# Altium schematic sheet CATS-GS-PM.SchDoc: CATS Groundstation
size A4; DocumentNumber: Overview; Revision: V1.0; SheetNumber: 2; SheetTotal: 9; Author: Luca Jost; Subtitle: Power Management
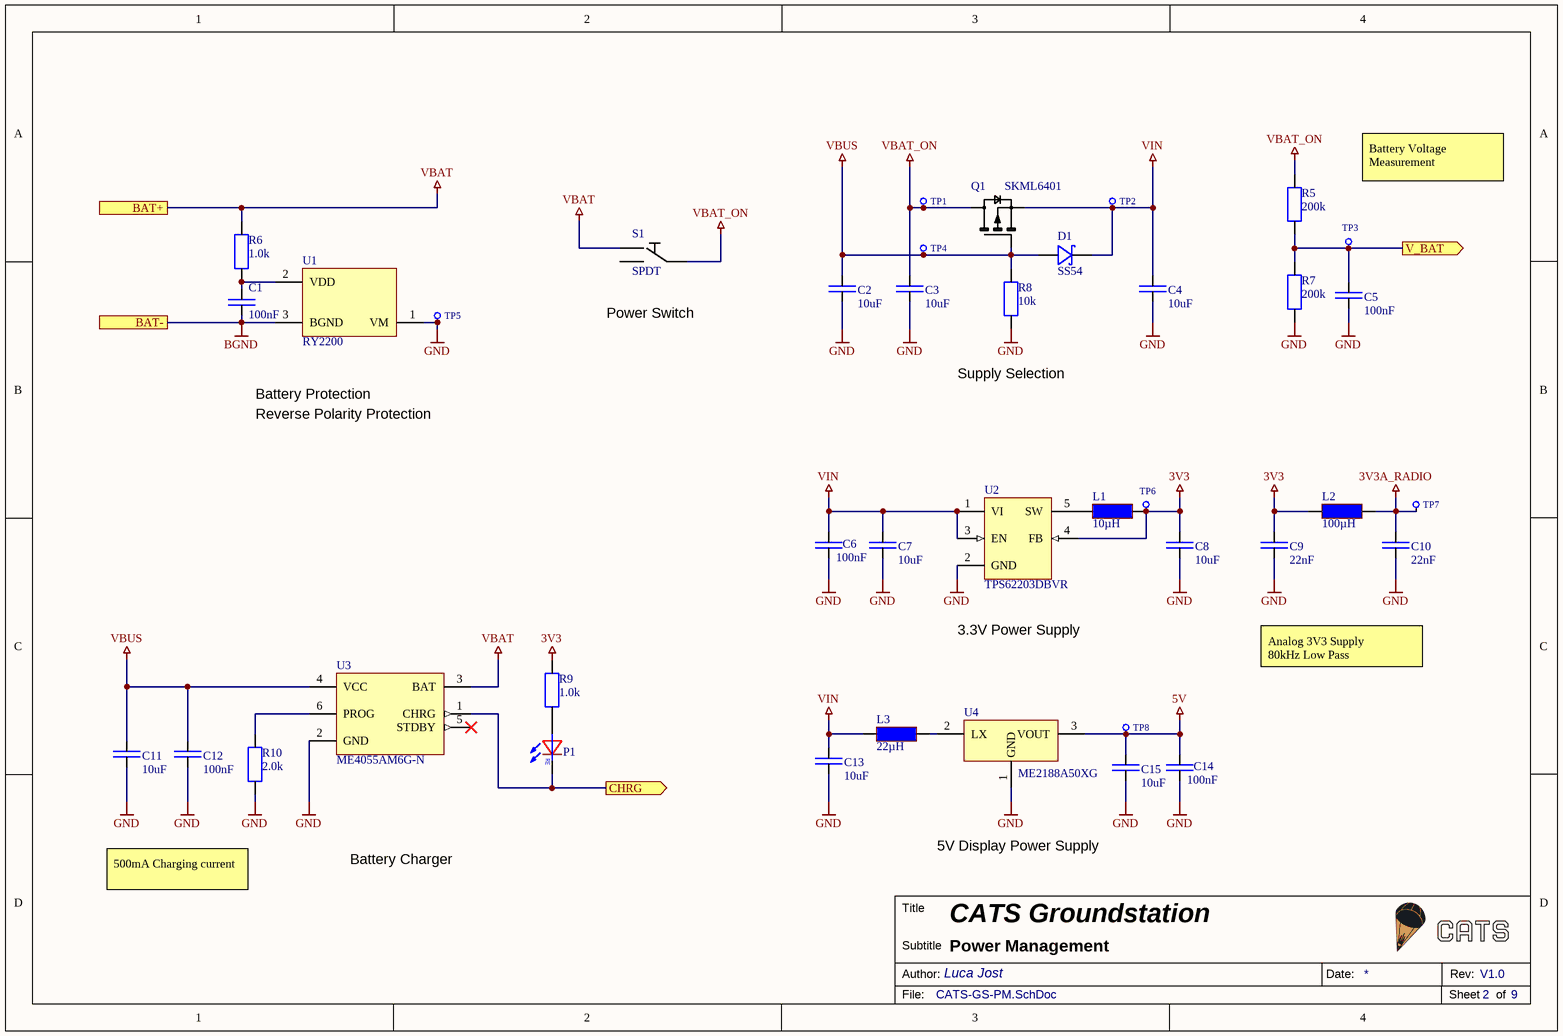
[diagram p0: CATS-GS-PM.SchDoc]

## Parts
C1  100nF  [SMD Keramikkondensator 0402]
C2  10uF  [SMD Keramikkondensator 0603]
C3  10uF  [SMD Keramikkondensator 0603]
C4  10uF  [SMD Keramikkondensator 0603]
C5  100nF  [SMD Keramikkondensator 0402]
C6  100nF  [SMD Keramikkondensator 0402]
C7  10uF  [SMD Keramikkondensator 0603]
C8  10uF  [SMD Keramikkondensator 0603]
C9  22nF  [SMD Keramikkondensator 0603]
C10  22nF  [SMD Keramikkondensator 0603]
C11  10uF  [SMD Keramikkondensator 0603]
C12  100nF  [SMD Keramikkondensator 0402]
C13  10uF  [SMD Keramikkondensator 0603]
C14  100nF  [SMD Keramikkondensator 0402]
C15  10uF  [SMD Keramikkondensator 0603]
D1  SS54  [SMD Diode DO-214-AC]
L1  10µH  [SMD Inductor 4x4x1.8]
L2  100µH  [SMD Inductor 1812]
L3  22µH  [SMD Inductor 4x4x1.8]
P1  LED  [SMD LED 0603]  (value not drawn)
Q1  SKML6401  [SMD MOSFET SOT-23]
R5  200k  [SMD Widerstand 0402]
R6  1.0k  [SMD Widerstand 0402]
R7  200k  [SMD Widerstand 0402]
R8  10k  [SMD Widerstand 0402]
R9  1.0k  [SMD Widerstand 0402]
R10  2.0k  [SMD Widerstand 0402]
S1  SPDT  [SMD Switch SPDT 90° G-Switch]
TP1  X-TP  [SMD Testpoint 1mm]  (value not drawn)  (no BOM)
TP2  X-TP  [SMD Testpoint 1mm]  (value not drawn)  (no BOM)
TP3  X-TP  [SMD Testpoint 1mm]  (value not drawn)  (no BOM)
TP4  X-TP  [SMD Testpoint 1mm]  (value not drawn)  (no BOM)
TP5  X-TP  [SMD Testpoint 1mm]  (value not drawn)  (no BOM)
TP6  X-TP  [SMD Testpoint 1mm]  (value not drawn)  (no BOM)
TP7  X-TP  [SMD Testpoint 1mm]  (value not drawn)  (no BOM)
TP8  X-TP  [SMD Testpoint 1mm]  (value not drawn)  (no BOM)
U1  RY2200  [SMD IC SOT-23]
U2  TPS62203DBVR  [SMD IC SOT-23-5]
U3  ME4055AM6G-N  [SMD IC SOT-23-6]
U4  ME2188A50XG  [SMD IC SOT-23]

## Ports
BAT+, BAT-, CHRG (out), V_BAT (out)

## Nets
3V3: C8.2 C9.2 L1.2 L2.1 R9.2 TP6.1 U2.4(FB)
3V3A_RADIO: C10.2 L2.2 TP7.1
5V: C14.2 C15.2 TP8.1 U4.3(VOUT)
BGND: C1.1 U1.3(BGND) ; port BAT-
GND: C2.1 C3.1 C4.1 C5.1 C6.1 C7.1 C8.1 C9.1 C10.1 C11.1 C12.1 C13.1 C14.1 C15.1 R7.1 R8.1 R10.1 TP5.1 U1.1(VM) U2.2(GND) U3.2(GND) U4.1(GND)
VBAT: R6.2 S1.3 U3.3(BAT) ; port BAT+
VBAT_ON: C3.2 Q1.D R5.2 S1.2 TP1.1
VBUS: C2.2 C11.2 C12.2 D1.A Q1.G R8.2 TP4.1 U3.4(VCC)
VIN: C4.2 C6.2 C7.2 C13.2 D1.K L3.1 Q1.S TP2.1 U2.1(VI) U2.3(EN)
CHRG: P1.K U3.1(CHRG) ; port CHRG
V_BAT: C5.2 R5.1 R7.2 TP3.1 ; port V_BAT
NetC1_2: C1.2 R6.1 U1.2(VDD)
NetL1_1: L1.1 U2.5(SW)
NetL3_2: L3.2 U4.2(LX)
NetP1_A: P1.A R9.1
NetR10_2: R10.2 U3.6(PROG)

Not connected (* = marked no-connect by the designer): S1 1; U3 5(STDBY)*

## Notes on the sheet
- Battery Voltage Measurement
- (near S1) Power Switch
- (near R8) Supply Selection
- Reverse Polarity Protection
- Battery Protection
- 3.3V Power Supply
- Analog 3V3 Supply
  80kHz Low Pass
- 5V Display Power Supply
- 500mA Charging current
- Battery Charger
- Title
- Author:
- Subtitle
- Date:
- Rev:
- File:
- Sheet
- of
- (in symbol LED) RE

## Library data of the parts
C1 C5 C6 C12 C14 = E6 - 100nF: SMD Ceramic Capacitor E6; Unit Price: 0.01; JLC: C307331
C2-C4 C7 C8 C11 C13 C15 = E6 - 10uF: SMD Ceramic Capacitor E6; Unit Price: 0.01; JLC: C70225
C9 C10 = E6 - 22nF: SMD Ceramic Capacitor E6; Unit Price: 0.01; JLC: C1729
D1 = SS54: 40V 5A 550mV @ 5A SMA(DO-214AC) Schottky Barrier Diodes (SBD) ROHS; ComponentLink1Description: Datasheet; ComponentLink1URL: https://datasheet.lcsc.com/lcsc/1810192041_MDD%EF%BC%88Microdiode-Electronics%EF%BC%89-SS54_C22452.pdf; JLC: C22452; Unit Price: 0.07
L1 = Inductor 10µH / 1.6A: 165mOhm SMD, 1.6A; ComponentLink1Description: Datasheet; ComponentLink1URL: https://datasheet.lcsc.com/lcsc/2108131530_SXN-Shun-Xiang-Nuo-Elec-SMNR4020-10UH_C135263.pdf; JLC: C135263; Unit Price: 0.07
L2 = Inductor 100µH / 0.25A: 0.25A 100µH ±20% 144mΩ SMD Power Inductors; ComponentLink1Description: Datasheet; ComponentLink1URL: https://datasheet.lcsc.com/lcsc/2110081330_Sunlord-SPH252012H3R3MT_C98379.pdf; JLC: C76822; Unit Price: 0.19
L3 = Inductor 22µH / 1A: 350mOhm SMD, 1A; ComponentLink1Description: Datasheet; ComponentLink1URL: https://datasheet.lcsc.com/lcsc/2108131530_SXN-Shun-Xiang-Nuo-Elec-SMNR4020-22UH_C135264.pdf; JLC: C135264
P1 = LED: Color LED; JLC: C2286
Q1 = SKML6401: P Channel MOSFET, 16V 3A, SOT-23; JLC: C475708; ComponentLink1Description: Datasheet; ComponentLink1URL: https://datasheet.lcsc.com/lcsc/2001131004_Shikues-SKML6401_C475708.pdf
R5 R7 = E24 - 200k: SMD Chip Resistor E24; Unit Price: 0.01; JLC: C25764
R6 R9 = E24 - 1.0k: SMD Chip Resistor E24; Unit Price: 0.01; JLC: C11702
R8 = E24 - 10k: SMD Chip Resistor E24; Unit Price: 0.01; Number: -; Supplier: -; JLC: C25744
R10 = E24 - 2.0k: SMD Chip Resistor E24; Unit Price: 0.01; Number: -; Supplier: -; JLC: C25879
S1 = Switch SPDT G-Switch: Slide Switch SPDT SMD; ComponentLink1Description: Datasheet; ComponentLink1URL: https://datasheet.lcsc.com/lcsc/2009021103_G-Switch-MK-12C02-G025_C778186.pdf; JLC: C778186
TP1 TP2 TP4 TP5 TP7 TP8 = X-TP: Testpunkt; Component Value: Ø 0.8mm; Component Description: Testpoint; Unit Price: 0.00
TP3 TP6 = X-TP: Testpunkt; Unit Price: 0.00
U1 = RY2200: One Cell Li-ion and Li-poly Battery Protection IC; JLC: C2888102; ComponentLink1Description: Datasheet; ComponentLink1URL: https://datasheet.lcsc.com/lcsc/2108251630_RYCHIP-Semiconductor-Inc--RY2200_C2888102.pdf
U2 = TPS62203DBVR: High-Efficiency Synchronous Step-Down / synchronous step-down converters ideally suited for Converter 3.3V; ComponentLink1Description: Datasheet; ComponentLink1URL: https://www.ti.com/lit/ds/symlink/tps62203.pdf?HQS=dis-mous-null-mousermode-dsf-pf-null-wwe&ts=1645451444570&ref_url=https%253A%252F%252Fwww.mouser.ch%252F; JLC: C9051; Unit Price: 1.03
U3 = ME4055AM6G-N: 800mA Lithium Ion Battery Linear Charger; ComponentLink1Description: Datasheet; ComponentLink1URL: https://datasheet.lcsc.com/lcsc/1809291612_MICRONE-Nanjing-Micro-One-Elec-ME4055AM6G-N_C82121.pdf; JLC: C82121; Unit Price: 0.10
U4 = ME2188A50XG: Fixed 5V Boost Converter; ComponentLink1Description: Datasheet; ComponentLink1URL: https://datasheet.lcsc.com/lcsc/1809041040_MICRONE-Nanjing-Micro-One-Elec-ME2188A50XG_C236769.pdf; JLC: C236769